# EAGLE design adapter (EAGLE 9.3.0)
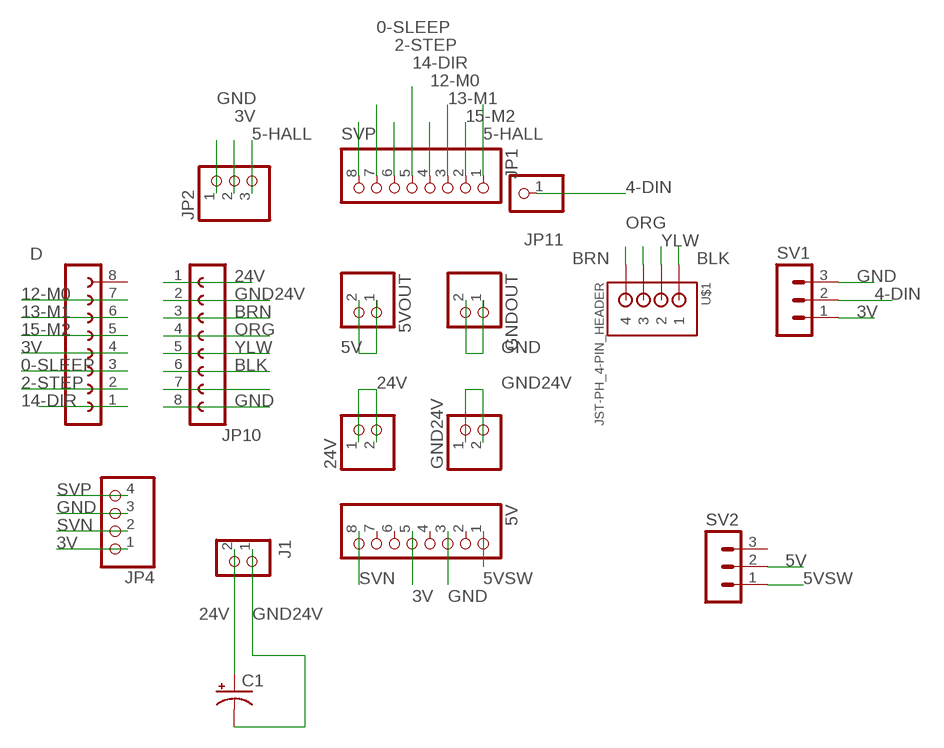
[diagram p0: schematic, sheet 1]

## Parts
5V  PINHD-1X8  [1X08]
5VOUT  PINHD-1X2  [1X02]
24V  PINHD-1X2  [1X02]
C1  CPOL-USE5-6  [E5-6]
D  FE08-1  [FE08]
GND24V  PINHD-1X2  [1X02]
GNDOUT  PINHD-1X2  [1X02]
J1  CON_TERMINAL_BLOCK_02-5MM  [TERMINAL_BLOCK_2P_5]
JP1  PINHD-1X8  [1X08]
JP2  PINHD-1X3  [1X03]
JP4  PINHD-1X4  [1X04]
JP10  FE08-1  [FE08]
JP11  PINHD-1X1  [1X01]
SV1  MA03-1  [MA03-1]
SV2  MA03-1  [MA03-1]
U$1  JST-PH_4-PIN_HEADER  [JST_B4B-PH_HEADER]

## Nets
0-SLEEP: D.3 JP1.7
2-STEP: D.2 JP1.6
3V: 5V.5 D.4 JP2.2 JP4.1 SV1.1
4-DIN: JP11.1 SV1.2
5-HALL: JP1.1 JP2.3
5V: 5VOUT.1 5VOUT.2 SV2.2
5VSW: 5V.1 SV2.1
12-M0: D.7 JP1.4
13-M1: D.6 JP1.3
14-DIR: D.1 JP1.5
15-M2: D.5 JP1.2
24V: 24V.1 24V.2 C1.+ J1.2 JP10.1
BLK: JP10.6 U$1.P1
BRN: JP10.3 U$1.P4
GND: 5V.3 GNDOUT.1 GNDOUT.2 JP2.1 JP4.3 JP10.8 SV1.3
GND24V: C1.- GND24V.1 GND24V.2 J1.1 JP10.2
N$5: JP10.7
ORG: JP10.4 U$1.P3
SVN: 5V.8 JP4.2
SVP: JP1.8 JP4.4
YLW: JP10.5 U$1.P2
Unconnected: 5V.2 5V.4 5V.6 5V.7 D.8 SV2.3

## Library data of the parts
5V JP1 = pinhead:PINHD-1X8: PIN HEADER
5VOUT 24V GND24V GNDOUT = pinhead:PINHD-1X2: PIN HEADER
C1 = rcl:CPOL-US: POLARIZED CAPACITOR, American symbol; SPICEPREFIX: C
D JP10 = con-lsta:FE08-1: FEMALE HEADER; OC_FARNELL: unknown; OC_NEWARK: unknown
J1 = dp_devices.v6:CON_TERMINAL_BLOCK_02: 2 poles wire to board terminal block
JP2 = pinhead:PINHD-1X3: PIN HEADER
JP4 = pinhead:PINHD-1X4: PIN HEADER
JP11 = pinhead:PINHD-1X1: PIN HEADER
SV1 SV2 = con-lstb:MA03-1: PIN HEADER; OC_FARNELL: unknown; OC_NEWARK: unknown
U$1 = SRG:JST-PH_4-PIN_HEADER: 4-pin JST PH Shrouded Header, top entry P/N B4B-PH-K-S Mating connector PHR-4 Mating cable assembly: Sparkfun PRT-09916 <http://www.sparkfun.com/products/9916>

## Net classes
0 default: clearance 0.1 mm

## Board
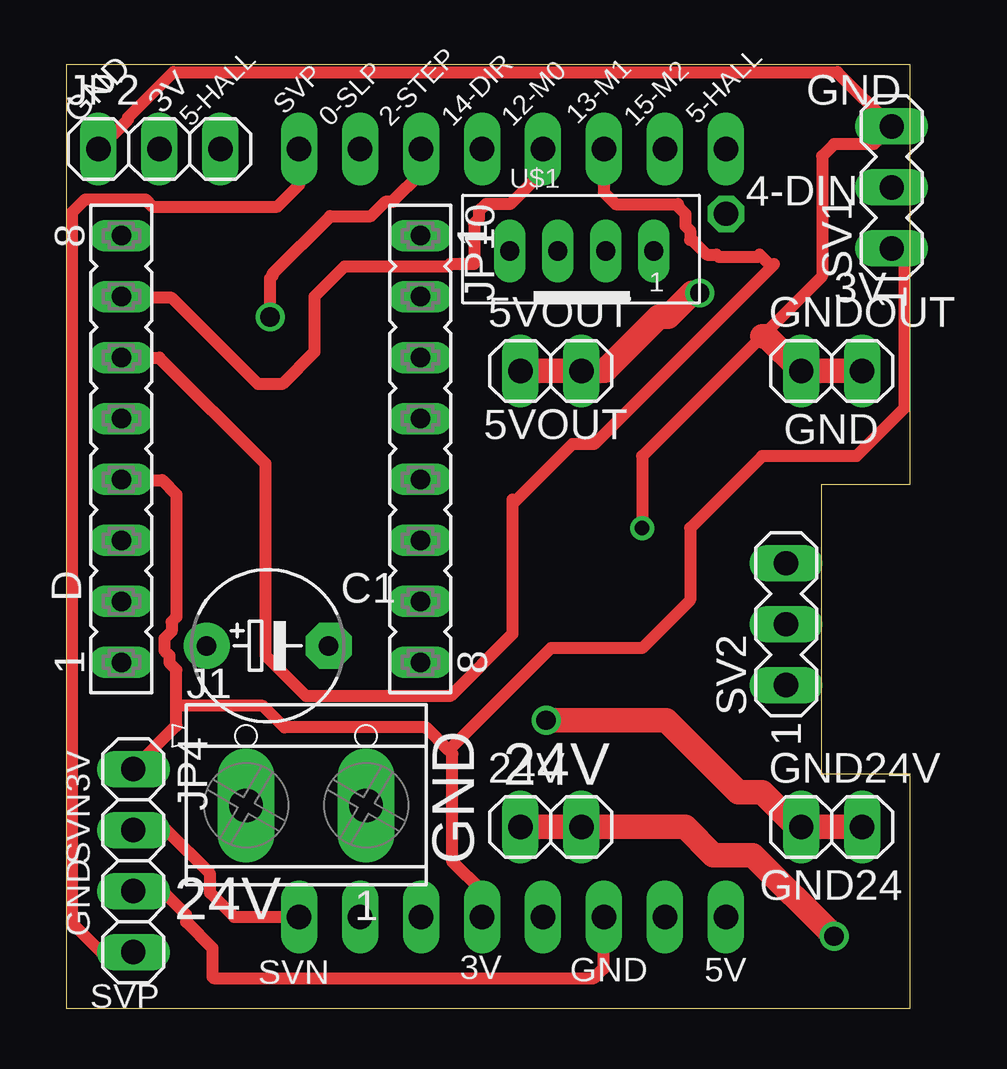
[diagram p1: board, top side]
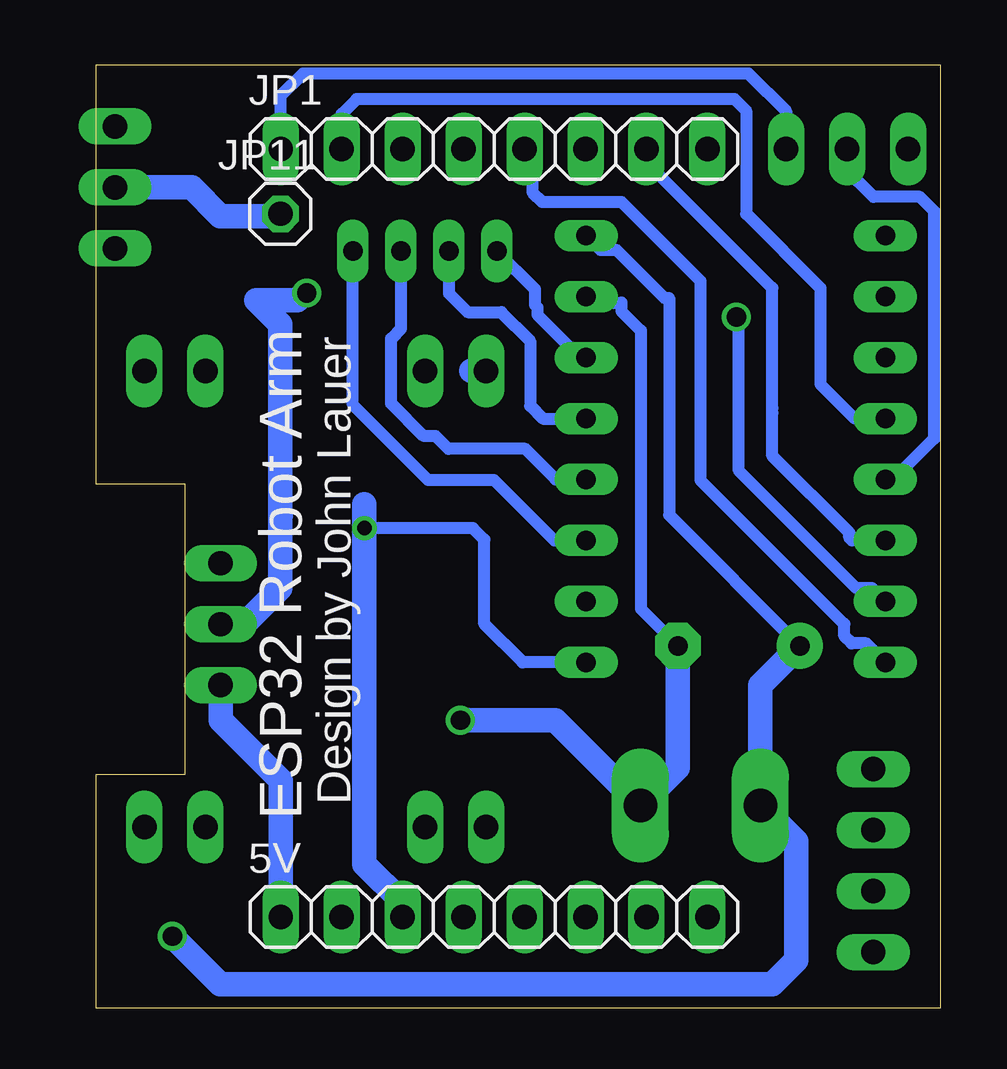
[diagram p2: board, bottom side, seen from below]

Size 35.18 x 39.3 mm. Coordinates in mm from the lower left corner, seen from the top.
Outline: 0,0 35.18,0 35.18,9.74 31.48,9.74 31.48,21.84 35.18,21.84 35.18,39.3 0,39.3 0,0
Copper layers (1*16): Top 0.035mm / dielectric 1.5mm / Bottom 0.035mm
Design rules "default *": minimum track width 6mil, minimum drill 0.35mm, track to track 6mil, track to pad 6mil, pad to pad 6mil, via to via 6mil, smd to smd 6mil, copper to edge 0mil, drill to drill 6mil, minimum pad ring 10mil, minimum via ring 8mil, stop-mask expansion 4mil, vias tented up to drill 0mil, thermal gap 10mil

### Footprints (pad centres in the part's own frame; a part is rotated, then mirrored left to right if it is on the bottom)
1X08 = drill 1.016 long: 1 -8.89,0; 2 -6.35,0; 3 -3.81,0; 4 -1.27,0; 5 1.27,0; 6 3.81,0; 7 6.35,0; 8 8.89,0
1X02 = drill 1.016 long: 1 -1.27,0; 2 1.27,0
E5-6 = drill 0.813 pad 1.905: + -2.54,0 | drill 0.813 pad 1.905 octagon: - 2.54,0
FE08 = drill 0.813 long: 1 -8.89,0; 2 -6.35,0; 3 -3.81,0; 4 -1.27,0; 5 1.27,0; 6 3.81,0; 7 6.35,0; 8 8.89,0
TERMINAL_BLOCK_2P_5 = drill 1.4 pad 2.38 long: 1 2.5,-0.45; 2 -2.5,-0.45
1X03 = drill 1.016 long: 1 -2.54,0; 2 0,0; 3 2.54,0
1X04 = drill 1.016 long: 1 -3.81,0; 2 -1.27,0; 3 1.27,0; 4 3.81,0
1X01 = drill 1.016 octagon: 1 0,0
MA03-1 = drill 1.016 long: 1 -2.54,0; 2 0,0; 3 2.54,0
JST_B4B-PH_HEADER = drill 0.8 long: P1 2.98,0.048; P2 0.98,0.048; P3 -1.02,0.048; P4 -3.02,0.048

### Placement (x,y rotation side)
5V  18.6,3.8 0 bottom
5VOUT  20.2,26.55 0 top
24V  20.2,7.55 0 top
C1  8.4,15.1 0 top
D  2.3,23.3 90 top
GND24V  31.9,7.55 0 top
GNDOUT  31.9,26.55 0 top
J1  10,8.9 0 top
JP1  18.6,35.8 0 bottom
JP2  3.89,35.8 0 top
JP4  2.8,6.15 270 top
JP10  14.76,23.3 270 top
JP11  27.5,33.1 0 bottom
SV1  34.4,34.2 90 top
SV2  30,16 90 top
U$1  21.5,31.5 0 top

### Tracks (layer width: path | path; a pad name or v marks a point on that pad's centre or on a via)
0-SLEEP
  Bottom 0.508: JP1.7 12.25,35.25 7,30 7,25 7,24.8 7,23 3.8,19.8 3.8,19.6 3.69,19.49 D.3
2-STEP  (via drill 0.8)
  Top 0.508: JP1.6 14.79,34.79 13.6,33.6 13.3,33.6 12.7,33 11,33 8.6,30.6 8.6,30.5 8.5,30.4 v8.5,28.8
  Bottom 0.508: D.2 2.85,17.5 3.5,17.5 8.4,22.4 8.4,28.7 v8.5,28.8
3V
  Top 0.508: D.4 2.33,22 4,22 4.6,21.4 4.6,16.3 4.4,16.1 4.4,15.7 4.1,15.4 4.1,14.9 4.3,14.7 4.3,14.4 4.6,14.1 4.6,12.6 | JP4.1 4.6,11.76 4.6,12.6 | 15.95,10.75 16.11,10.59 16.1,10.59 16.1,6.1 17.33,4.87 5V.5 | 15.95,10.75 15,11.7 9.1,11.7 8.2,12.6 4.6,12.6 | SV1.1 34.93,31.13 34.93,25 32.93,23 29,23 26,20 26,17 24,15 20.2,15 15.95,10.75
  Bottom 0.508: D.4 1.57,22.43 0.25,23.75 0.25,33.2 0.85,33.8 2.8,33.8 4,35 3.89,35.11 JP2.2
4-DIN
  Bottom 1.016: SV1.2 31.2,34.2 30,33 27.6,33 JP11.1
5-HALL
  Bottom 0.508: JP2.3 6.43,37.37 8,38.94 26.56,38.94 27.5,38 JP1.1
5V  (via drill 0.8)
  Top 1.016: v26.4,29.8 26.1,29.8 25.1,28.8 24.7,28.8 22.45,26.55 5VOUT.2 5VOUT.1
  Bottom 1.016: 27.49,20.49 27.5,20.5 | 27.5,20.5 27.5,17.5 29.2,15.8 29.4,16 SV2.2 | 19.55,26.55 5VOUT.1 | 27.5,20.5 27.5,28.5 28.5,29.5 26.8,29.5 26.4,29.9 v26.4,29.8
5VSW
  Bottom 0.152: 5V.1 27.49,3.51
  Bottom 1.016: 5V.1 27.49,9.49 29.99,11.99 SV2.1
12-M0
  Top 0.508: JP1.4 19.87,35.13 20,35 18.5,33.5 17.5,33.5 17.2,33.2 17.2,32.9 17,32.7 17,31 16,31 15.9,30.9 11.6,30.9 10.35,29.65 10.35,27.35 9,26 8,26 4.4,29.6 2.35,29.6 D.7
13-M1
  Top 0.508: 18.6,21.2 18.6,21 | 18.6,21 18.6,15.6 16,13 10,13 8.3,14.7 8.3,22.7 3.89,27.11 D.6 | 18.6,21 21.1,23.5 22,23.5 29.5,31 29.3,31 28.9,31.4 28.8,31.3 27.2,31.3 27.1,31.4 26.7,31.4 26.1,32 26,32 26,32.4 25.8,32.6 25.8,33.1 25.5,33.4 25.5,33.5 22.9,33.5 22.41,33.99 JP1.3
14-DIR
  Bottom 0.508: D.1 3.09,15.2 3.7,15.2 4,15.5 4,16 10,22 10,30.3 13.3,33.6 16.6,33.6 17,34 17,35.47 JP1.5
15-M2
  Bottom 0.508: D.5 3.57,24.57 5,26 5,30 8.1,33.1 8.1,37.4 8.58,37.88 24.32,37.88 24.95,37.25 JP1.2
24V  (via drill 0.8)
  Top 1.016: v32,3 28.62,6.38 26.97,6.38 25.8,7.55 24V.2 24V.1
  Bottom 0.508: C1.+ 11.31,20.55 11.31,29.6 11.5,29.6 13.5,31.6 14.17,31.6 JP10.1
  Bottom 1.016: C1.+ 7.5,13.46 J1.2 6,6.95 6,2 7,1 30,1 v32,3
BLK
  Bottom 0.508: U$1.P1 24.48,25.13 21.35,22 18.6,22 16.09,19.49 JP10.6
BRN
  Bottom 0.508: U$1.P4 16.9,29.97 16.9,29.3 16.8,29.2 16.8,28.9 15.01,27.11 JP10.3
GND  (via drill 0.6)
  Top 0.508: 5V.3 22.41,1.66 22,1.25 6.15,1.25 6.1,1.3 6.1,2.5 5,3.6 5,3.9 4.02,4.88 JP4.3 | JP2.1 2.57,37.02 2.57,37.11 4.47,39 32.14,39 SV1.3 33.66,36 32,36 31.5,35.5 31.5,30.5 29,28 24,23 v24,20 | 15.41,14.41 JP10.8
  Top 1.016: 29,28 29.18,28 GNDOUT.1 GNDOUT.2
  Bottom 0.508: v24,20 19.48,20 19,19.52 19,16 17.41,14.41 JP10.8
  Bottom 1.016: 5V.3 22.41,4.41 24,6 v24,20 24,21
GND24V  (via drill 0.8)
  Top 1.016: GND24V.2 GND24V.1 30.45,7.55 29,9 28,9 25,12 v20,12
  Bottom 0.508: C1.- 12.48,16.64 12.48,28.23 13.3,29.05 13.3,29.4 14.51,29.4 JP10.2
  Bottom 1.016: C1.- 10.94,10.01 J1.1 16.05,12 v20,12
ORG
  Bottom 0.508: U$1.P3 20.48,29.78 19.7,29 18.3,29 17.1,27.8 17.1,25.1 16.57,24.57 JP10.4
  Bottom 1.016: U$1.P3 20.48,31.04
SVN
  Top 0.508: 5V.8 7,3.8 6,4.8 6,5.6 4.18,7.42 JP4.2
SVP
  Top 0.508: JP1.8 9.71,34.31 8.8,33.4 3.6,33.4 3.3,33.7 0.8,33.7 0.25,33.15 0.25,3.55 1.46,2.34 JP4.4
  Bottom 0.152: JP1.8 10,35.51
YLW
  Bottom 0.508: U$1.P2 22.48,28.31 22.89,27.9 22.89,25.2 21.52,23.83 21.03,23.83 20.5,23.3 17.3,23.3 16.03,22.03 JP10.5

### Text on the board
tPlace: GND | GND | 3V | 5-HALL | SVP | 0-SLP | 2-STEP | 14-DIR | 12-M0 | 13-M1 | 15-M2 | 5-HALL | 4-DIN | 3V | 5VOUT | GND | 3V | 24V | SVN | GND | 24V | GND24 | GND | SVN | 3V | GND | 5V | SVP
bPlace: Design by John Lauer | ESP32 Robot Arm